# Altium schematic sheet Osc.SchDoc
size A4
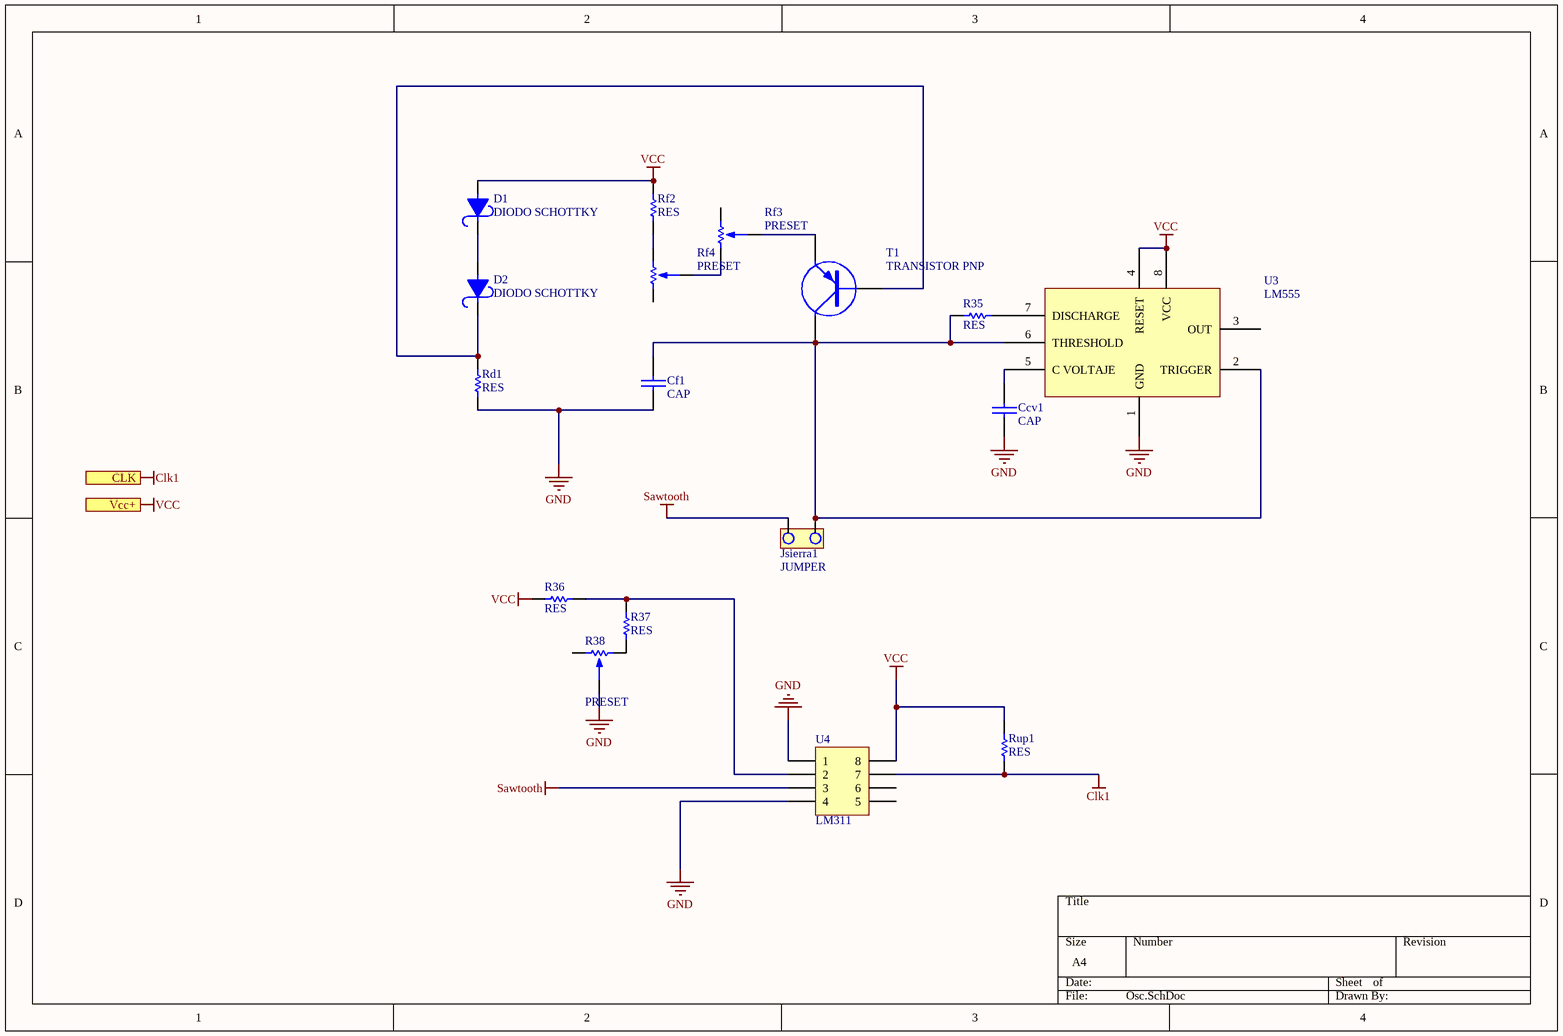
[diagram p0: Osc.SchDoc]

## Parts
Ccv1  CAP  [0805]
Cf1  CAP  [0805]
D1  DIODO SCHOTTKY  [DO41]
D2  DIODO SCHOTTKY  [DO41]
Jsierra1  JUMPER  [JUMPER2]
R35  RES  [0805]
R36  RES  [0805]
R37  RES  [0805]
R38  PRESET  [PRESET V]
Rd1  RES  [0805]
Rf2  RES  [0805]
Rf3  PRESET  [PRESET V]
Rf4  PRESET  [PRESET V]
Rup1  RES  [0805]
T1  TRANSISTOR PNP  [TO92]
U3  LM555  [DIP8]
U4  LM311  [DIP8]

## Ports
CLK, Vcc+

## Nets
Clk1: Rup1.1 U4.7 ; port CLK
GND: Ccv1.2 Cf1.2 R38.2 Rd1.1 U3.1(GND) U4.1 U4.4
Sawtooth: Jsierra1.1 U4.3
VCC: D1.1 R36.2 Rf2.2 Rup1.2 U3.4(RESET) U3.8(VCC) U4.8 ; port Vcc+
NetCcv1_1: Ccv1.1 U3.5(C_VOLTAJE)
NetCf1_1: Cf1.1 Jsierra1.2 R35.1 T1.2(C) U3.2(TRIGGER) U3.6(THRESHOLD)
NetD1_2: D1.2 D2.1
NetD2_2: D2.2 Rd1.2 T1.1(B)
NetR35_2: R35.2 U3.7(DISCHARGE)
NetR36_1: R36.1 R37.1 U4.2
NetR37_2: R37.2 R38.1
NetRf2_1: Rf2.1 Rf4.1
NetRf3_2: Rf3.2 T1.3(E)
NetRf3_3: Rf3.3 Rf4.2

Not connected (* = marked no-connect by the designer): R38 3; Rf3 1; Rf4 3; U3 3(OUT); U4 5 6

## Library data of the parts
U3 = LM555: Timer
U4 = IC_DIP8